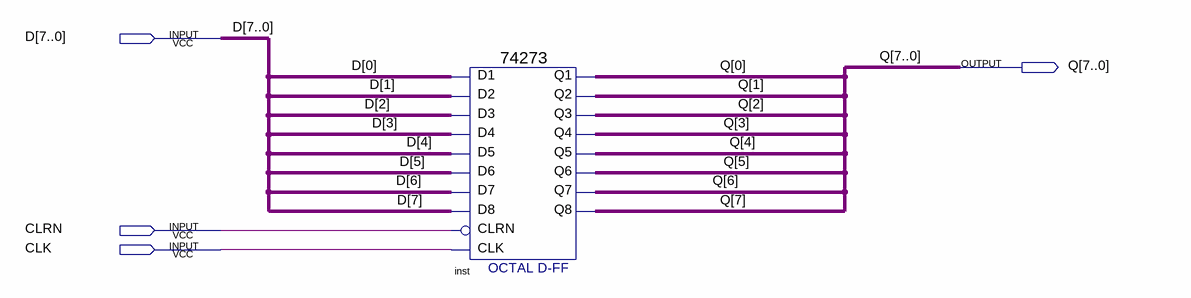
[diagram p0: schematic sheet]
// Quartus schematic MAR.bdf as structural Verilog: 1 symbols, 4 pins
module MAR (
  input  [7:0] D,
  input  CLRN,
  input  CLK,
  output [7:0] Q
);

  \74273  inst (
    .D2(D[1]), .D3(D[2]), .D1(D[0]), .D4(D[3]), .D7(D[6]), .D6(D[5]), .D5(D[4]), .D8(D[7]), .CLK(CLK),
    .CLRN(CLRN), .Q4(Q[3]), .Q1(Q[0]), .Q2(Q[1]), .Q3(Q[2]), .Q6(Q[5]), .Q5(Q[4]), .Q7(Q[6]), .Q8(Q[7]));
endmodule
